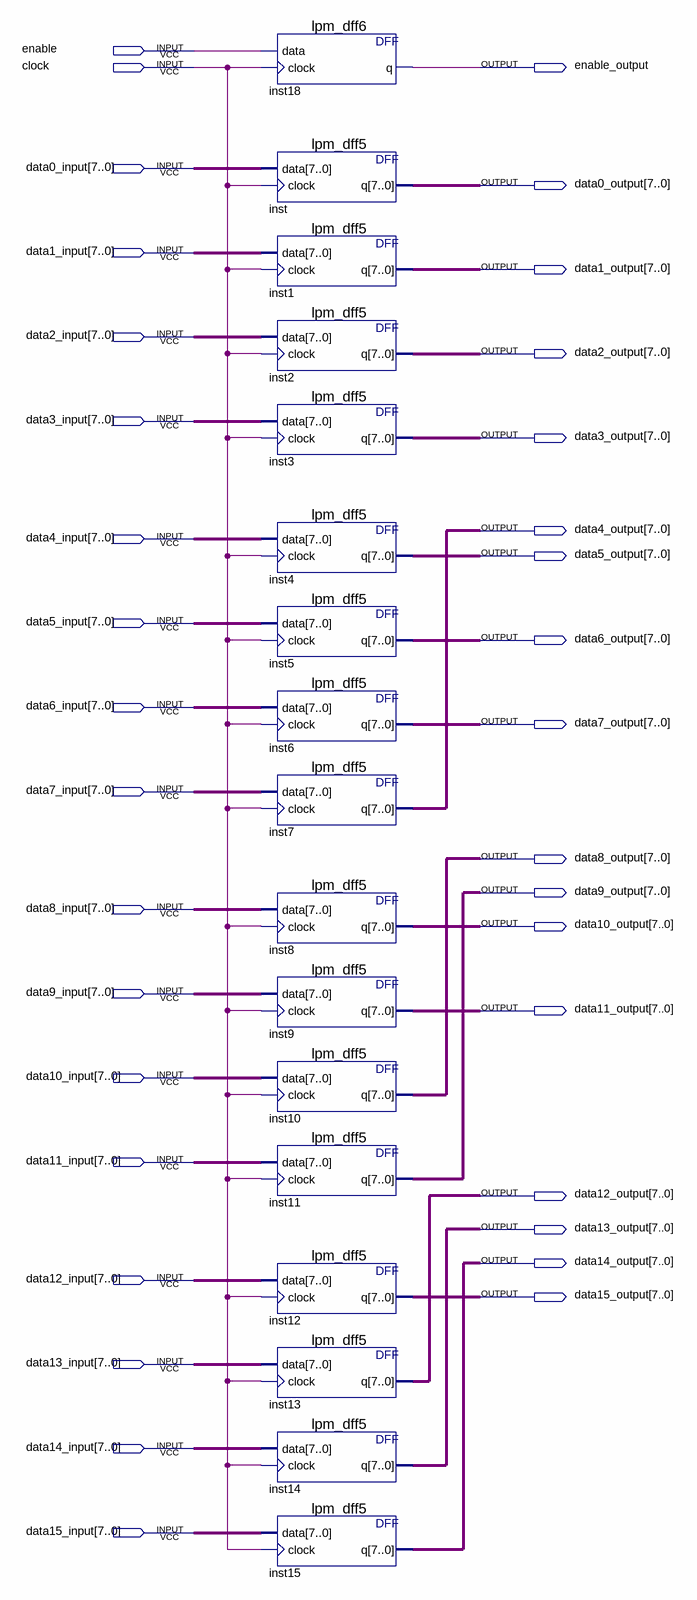
[diagram p0: schematic sheet]
// Quartus schematic inv_shift_rows.bdf as structural Verilog: 17 symbols, 35 pins
module inv_shift_rows (
  input  enable,
  input  clock,
  input  [7:0] data0_input,
  input  [7:0] data1_input,
  input  [7:0] data2_input,
  input  [7:0] data3_input,
  input  [7:0] data4_input,
  input  [7:0] data5_input,
  input  [7:0] data6_input,
  input  [7:0] data7_input,
  input  [7:0] data8_input,
  input  [7:0] data9_input,
  input  [7:0] data10_input,
  input  [7:0] data11_input,
  input  [7:0] data12_input,
  input  [7:0] data13_input,
  input  [7:0] data14_input,
  input  [7:0] data15_input,
  output enable_output,
  output [7:0] data0_output,
  output [7:0] data1_output,
  output [7:0] data2_output,
  output [7:0] data3_output,
  output [7:0] data4_output,
  output [7:0] data5_output,
  output [7:0] data6_output,
  output [7:0] data7_output,
  output [7:0] data8_output,
  output [7:0] data9_output,
  output [7:0] data10_output,
  output [7:0] data11_output,
  output [7:0] data12_output,
  output [7:0] data13_output,
  output [7:0] data14_output,
  output [7:0] data15_output
);

  lpm_dff6 inst18 (.data(enable), .clock(clock), .q(enable_output));
  lpm_dff5 inst (.data(data0_input), .clock(clock), .q(data0_output));
  lpm_dff5 inst1 (.data(data1_input), .clock(clock), .q(data1_output));
  lpm_dff5 inst2 (.data(data2_input), .clock(clock), .q(data2_output));
  lpm_dff5 inst3 (.data(data3_input), .clock(clock), .q(data3_output));
  lpm_dff5 inst4 (.data(data4_input), .clock(clock), .q(data5_output));
  lpm_dff5 inst5 (.data(data5_input), .clock(clock), .q(data6_output));
  lpm_dff5 inst6 (.data(data6_input), .clock(clock), .q(data7_output));
  lpm_dff5 inst7 (.data(data7_input), .clock(clock), .q(data4_output));
  lpm_dff5 inst8 (.data(data8_input), .clock(clock), .q(data10_output));
  lpm_dff5 inst9 (.data(data9_input), .clock(clock), .q(data11_output));
  lpm_dff5 inst10 (.data(data10_input), .clock(clock), .q(data8_output));
  lpm_dff5 inst11 (.data(data11_input), .clock(clock), .q(data9_output));
  lpm_dff5 inst12 (.data(data12_input), .clock(clock), .q(data15_output));
  lpm_dff5 inst13 (.data(data13_input), .clock(clock), .q(data12_output));
  lpm_dff5 inst14 (.data(data14_input), .clock(clock), .q(data13_output));
  lpm_dff5 inst15 (.data(data15_input), .clock(clock), .q(data14_output));
endmodule
